# Altium schematic sheet Altium_Schematic_Rev3.SchDoc: ESP32-S3 CO2 Board
size Letter; DrawnBy: x; Engineer: x; DocumentNumber: 1; Revision: 3; SheetNumber: 1; SheetTotal: 1; ImagePath: x
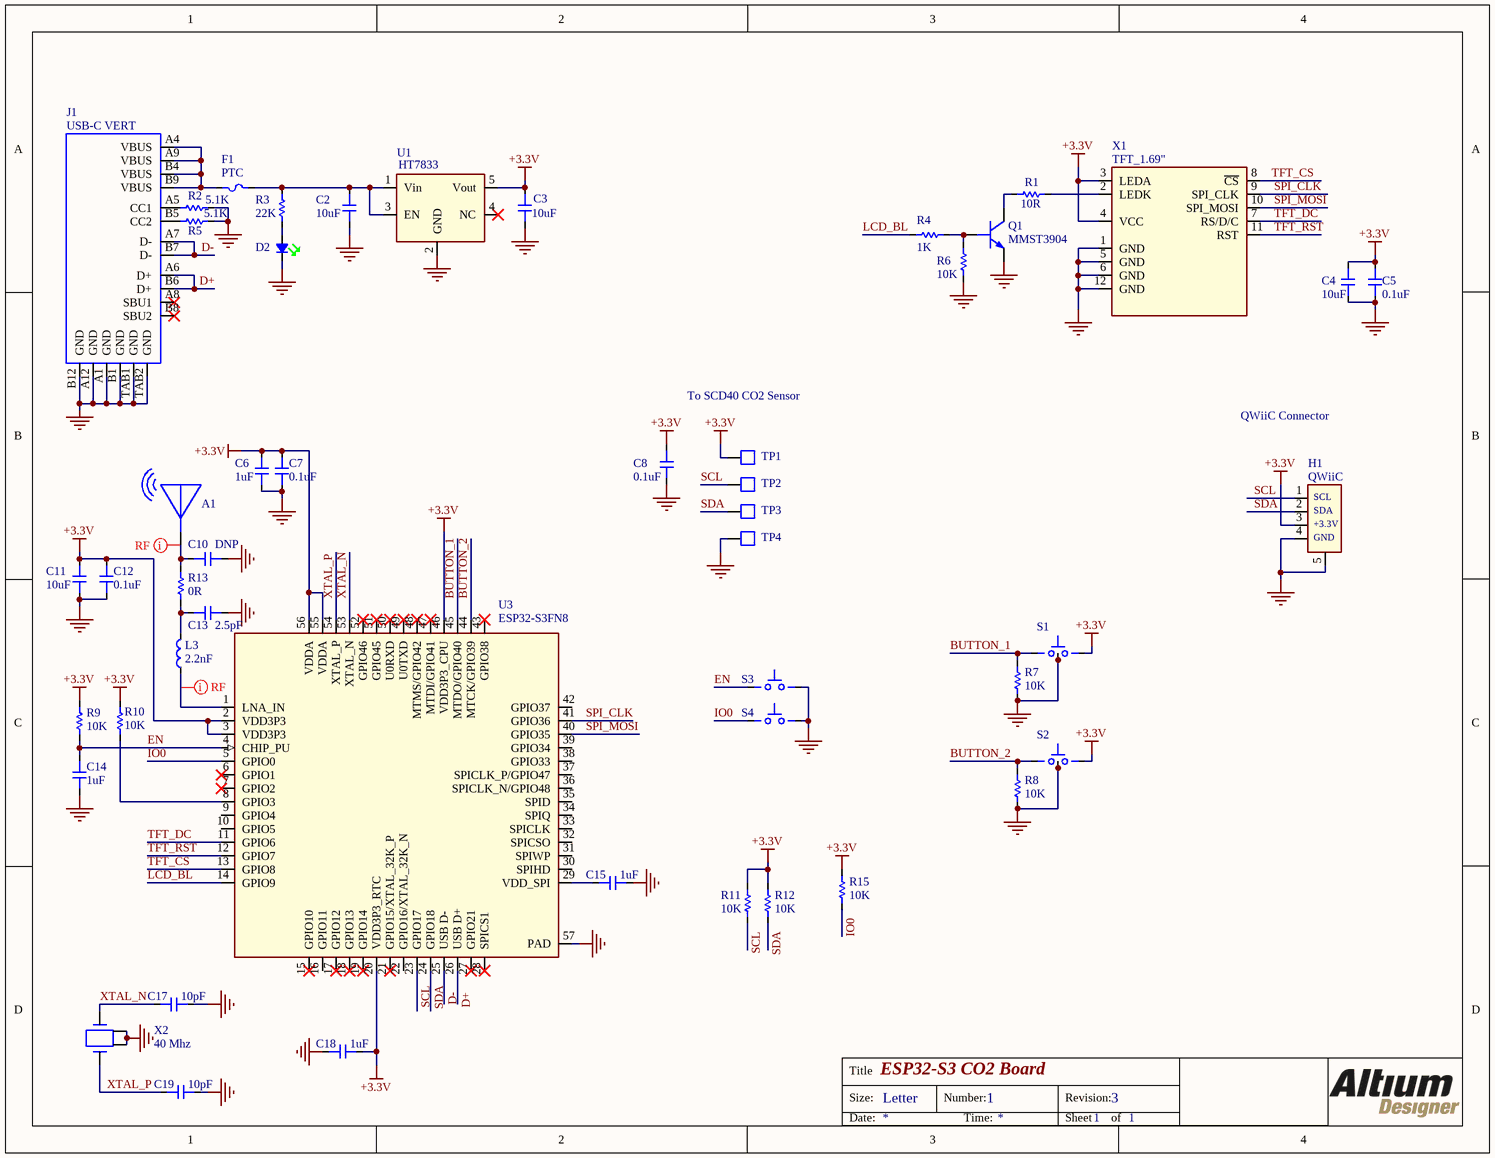
[diagram p0: Altium_Schematic_Rev3.SchDoc]

## Parts
A1  ANT3216LL00R2400A  [ANT3216LL00R2400A]  (value not drawn)
C2  10uF  [CAPC2012X140N]
C3  10uF  [CAPC2012X140N]
C4  10uF  [CAPC2012X140N]
C5  0.1uF  [CAPC1608X09L]
C6  1uF  [CAPC1608X09L]
C7  0.1uF  [CAPC1608X09L]
C8  0.1uF  [CAPC1608X09L]
C10  DNP  [CAPC1005X56N]  (no BOM)
C11  10uF  [CAPC2012X140N]
C12  0.1uF  [CAPC1005X56N]
C13  2.5pF  [CAPC1005X56N]
C14  1uF  [CAPC1005X56N]
C15  1uF  [CAPC1005X56N]
C17  10pF  [CAPC1005X56N]
C18  1uF  [CAPC1608X09L]
C19  10pF  [CAPC1005X56N]
D2  Green Led  [LED1005X40N-Green]  (value not drawn)
F1  PTC  [RESC1608X06L (0603 FOOTPRINT)]
H1  QWiiC  [SM04B-SRSS-TB]
J1  USB-C VERT  [TYPE-C-31-G-06]
L3  2.2nF  [INDC1005X40L]
Q1  MMST3904  [SC-70]
R1  10R  [RESC1005X40L (0402 FOOTPRINT)]
R2  5.1K  [RESC1005X40L (0402 FOOTPRINT)]
R3  22K  [RESC1005X40L (0402 FOOTPRINT)]
R4  1K  [RESC1005X40L (0402 FOOTPRINT)]
R5  5.1K  [RESC1005X40L (0402 FOOTPRINT)]
R6  10K  [RESC1005X40L (0402 FOOTPRINT)]
R7  10K  [RESC1005X40L (0402 FOOTPRINT)]
R8  10K  [RESC1005X40L (0402 FOOTPRINT)]
R9  10K  [RESC1005X40L (0402 FOOTPRINT)]
R10  10K  [RESC1005X40L (0402 FOOTPRINT)]
R11  10K  [RESC1005X40L (0402 FOOTPRINT)]
R12  10K  [RESC1005X40L (0402 FOOTPRINT)]
R13  0R  [RESC1005X40L (0402 FOOTPRINT)]
R15  10K  [RESC1005X40L (0402 FOOTPRINT)]
S1  Push  [1TS003A-1600-3500A]  (value not drawn)
S2  Push  [1TS003A-1600-3500A]  (value not drawn)
S3  (no value)  [TL1015AF160QG]
S4  (no value)  [TL1015AF160QG]
TP1  Test Point, 1mm Top Layer  [TP100TL]  (value not drawn)  (no BOM)
TP2  Test Point, 1mm Top Layer  [TP100TL]  (value not drawn)  (no BOM)
TP3  Test Point, 1mm Top Layer  [TP100TL]  (value not drawn)  (no BOM)
TP4  Test Point, 1mm Top Layer  [TP100TL]  (value not drawn)  (no BOM)
U1  HT7833  [SOT95P280X144-5N]
U3  ESP32-S3FN8  [QFN56_0.4mm pitch - Rev2]
X1  TFT_1.69"  [TFT_GLASS 1.69 INCH SPI]
X2  40 Mhz  [OSC20X16]

## Nets
+3.3V: C3.1 C4.1 C5.1 C6.1 C7.1 C8.1 C11.1 C12.1 C18.2 H1.3 R9.2 R10.1 R11.1 R12.1 R15.2 S1.2(B) S2.2(B) TP1.1 U1.5(Vout) U3.2(VDD3P3) U3.3(VDD3P3) U3.20(VDD3P3_RTC) U3.46(VDD3P3_CPU) U3.55(VDDA) U3.56(VDDA) X1.3(LEDA) X1.4(VCC)
GND: C2.2 C3.2 C4.2 C5.2 C6.2 C7.2 C8.2 C10.2 C11.2 C12.2 C13.2 C14.2 C15.2 C17.2 C18.1 C19.2 D2.1 H1.4 H1.5 J1.A1(GND) J1.A12(GND) J1.B1(GND) J1.B12(GND) J1.TAB1(GND) J1.TAB2(GND) Q1.2(E) R2.1 R5.1 R6.2 R7.1 R8.1 S1.3 S1.4 S2.3 S2.4 S3.2(B) S4.2(B) TP4.1 U1.2(GND) U3.57(PAD) X1.1(GND) X1.5(GND) X1.6(GND) X1.12(GND) X2.2 X2.4
BUTTON_1: R7.2 S1.1(A) U3.45(MTDO/GPIO40)
BUTTON_2: R8.2 S2.1(A) U3.44(MTCK/GPIO39)
D+: J1.A6(D+) J1.B6(D+) U3.26(USB_D+)
D-: J1.A7(D-) J1.B7(D-) U3.25(USB_D-)
EN: C14.1 R9.1 S3.1(A) U3.4(CHIP_PU)
IO0: R15.1 S4.1(A) U3.5(GPIO0)
LCD_BL: R4.2 U3.14(GPIO9)
SCL: H1.1 R11.2 TP2.1 U3.23(GPIO17)
SDA: H1.2 R12.2 TP3.1 U3.24(GPIO18)
SPI_CLK: U3.41(GPIO36) X1.9(SPI_CLK)
SPI_MOSI: U3.40(GPIO35) X1.10(SPI_MOSI)
TFT_CS: U3.13(GPIO8) X1.8(~{CS})
TFT_DC: U3.11(GPIO6) X1.7(RS/D/C)
TFT_RST: U3.12(GPIO7) X1.11(RST)
XTAL_N: C17.1 U3.53(XTAL_N) X2.3
XTAL_P: C19.1 U3.54(XTAL_P) X2.1
NetA1_1: A1.1 C10.1 R13.2
NetC2_1: C2.1 F1.1 R3.2 U1.1(Vin) U1.3(EN)
NetC13_1: C13.1 L3.1 R13.1
NetC15_1: C15.1 U3.29(VDD_SPI)
NetD2_2: D2.2 R3.1
NetF1_2: F1.2 J1.A4(VBUS) J1.A9(VBUS) J1.B4(VBUS) J1.B9(VBUS)
NetJ1_A5: J1.A5(CC1) R2.2
NetJ1_B5: J1.B5(CC2) R5.2
NetL3_2: L3.2 U3.1(LNA_IN)
NetQ1_1: Q1.1(B) R4.1 R6.1
NetQ1_3: Q1.3(C) R1.2
NetR1_1: R1.1 X1.2(LEDK)
NetR10_2: R10.2 U3.8(GPIO3)

Not connected (* = marked no-connect by the designer): J1 A8(SBU1)* B8(SBU2)*; U1 4(NC)*; U3 6(GPIO1)* 7(GPIO2)* 9(GPIO4) 10(GPIO5) 15(GPIO10)* 16(GPIO11) 17(GPIO12)* 18(GPIO13)* 19(GPIO14)* 21(GPIO15/XTAL_32K_P)* 22(GPIO16/XTAL_32K_N) 27(GPIO21)* 28(SPICS1)* 30(SPIHD) 31(SPIWP) 32(SPICSO) 33(SPICLK) 34(SPIQ) 35(SPID) 36(SPICLK_N/GPIO48) 37(SPICLK_P/GPIO47) 38(GPIO33) 39(GPIO34) 42(GPIO37) 43(GPIO38)* 47(MTDI/GPIO41)* 48(MTMS/GPIO42)* 49(U0TXD)* 50(U0RXD)* 51(GPIO45)* 52(GPIO46)*

## Layout directives
net class RF: NetA1_1, NetL3_2

## Notes on the sheet
- To SCD40 CO2 Sensor
- QWiiC Connector
- Title
- Size:
- Letter
- Number:
- Revision:
- Date:
- Time:
- Sheet
- of
- (in symbol SM04B-SRSS-TB) SCL; SDA; +3.3V; GND

## Library data of the parts
A1 = ANT3216LL00R2400A: Antenna Chip 2.4Gig; Manufacturer: YAGEO; Vendor: LCSC; Value: Chip Antenna; Part_Number: ANT3216LL00R2400A
C2 C3 C11 = CAP_0805: CAP 10uF 50V 0805; Part_Footprint: 0805; Value: 10uF
C4 = CAP_0805: CAP 10uF 0805; Part_Footprint: 0805; Value: 10uF
C5 C7 C8 = CAP_0603: CAP 0.1uF 0603; Part_Footprint: 0603; Value: 0.1uF
C6 C18 = CAP_0603: CAP 1uF 0603; Part_Footprint: 0603; Value: 1uF
C10 = CAP_0402: CAP DNP 0402; Part_Footprint: 0402; Value: DNP
C12 = CAP_0402: CAP 0.1uF 0402; Part_Footprint: 0402; Value: 0.1uF
C13 = CAP_0402: CAP 2.5pF 0402; Part_Footprint: 0402; Value: 2.5pF
C14 C15 = CAP_0402: CAP 1uF 0402; Part_Footprint: 0402; Value: 1uF
C17 C19 = CAP_0402: CAP 10pF 0402; Part_Footprint: 0402; Value: 10pF
D2 = LED_0402_SMALL_GREEN: LED Green 0402; Part_Number: C74338; Part_Footprint: 0402; Vendor: LCSC; Value: Green Led
F1 = PTC_FUSE_0603: PTC FUSE 0.5mA hold, 1A trip 0603; Manufacturer: JDT Fuse; Part_Number: C2982257; Vendor: LCSC; Value: PTC
H1 = SM04B-SRSS-TB: CONN HEADER 4POS .100 R/A QWIIC; Manufacturer: JST; Part_Number: PRT-14417; Vendor: Digi-Key; Value: QWiiC
J1 = USB-C_VERT: CONN RECPT USB-C Vertical; Manufacturer: Korean Elec; Part_Number: C283539; Part_Footprint: SMT; Vendor: LCSC; Value: USB-C VERT
L3 = Inductor: Inductor 2.2nF; Value: 2.2nF; Part_Footprint: *
Q1 = MMST3904: TRANSISTOR NPN GP 40V SC-70; Manufacturer: Changjiang; Part_Number: C54879; Vendor: LCSC; Part_Footprint: SC-70; Value: MMST3904
R1 = RES_0402: RES 10R 0402; Part_Footprint: 0402; Value: 10R
R2 R5 = RES_0402: RES 5.1K 0402; Part_Footprint: 0402; Value: 5.1K
R3 = RES_0402: RES 22K 0402; Part_Footprint: 0402; Value: 22K
R4 = RES_0402: RES 1K 0402; Part_Footprint: 0402; Value: 1K
R6-R12 R15 = RES_0402: RES 10K 0402; Part_Footprint: 0402; Value: 10K
R13 = RES_0402: RES 0R 0402; Part_Footprint: 0402; Value: 0R
S1 S2 = SWITCH TACTILE R/A_MICRO: SWITCH TACTILE R/A MICRO; Part_Number: C255805; Manufacturer: HYP; Value: Switch R/A Micro; Vendor: LCSC
S3 S4 = TL1015AF160QG: SWITCH MOMENTARY; Part_Footprint: SMD; Vendor: Digi-Key; Part_Number: TL1015AF160QG
U1 = HT7833: IC LDO 3.3V 0.5A SOT23-5; Manufacturer: Holtek; Part_Number: C164106; Vendor: LCSC; Value: HT7833; Part_Footprint: SOT23-5
U3 = ESP32-S3: WIFI/Bluetooth, 8M PSRAM, QFN-56 7x7; Manufacturer: Espressif; Part_Footprint: QFN56; Part_Number: ESP32-S3FN8; Value: ESP32-S3FN8
X1 = TFT_GLASS 1.69 INCH COLOR SPI: 1.69 INCH TFT SPI GLASS COLOR ROUNDED CORNERS; Part_Number: LH169TIG01; Vendor: Aliexpress/Alibaba; Value: TFT_1.69"
X2 = 40Mhz: CRYSTAL 40MHZ 10PF SMD; Part_Number: ECS-400-10-37B2-CKM; Manufacturer: ECS; Vendor: Digi-Key; Value: 40 Mhz
TP1-TP4 = Test Point, 1mm Top Layer: Part_Number: N/A; Manufacturer: N/A; Part_Footprint: *